# EAGLE schematic PCB-E21-CMB6_v03-17 (EAGLE 7.7.0)

## Sheet 1 of 2
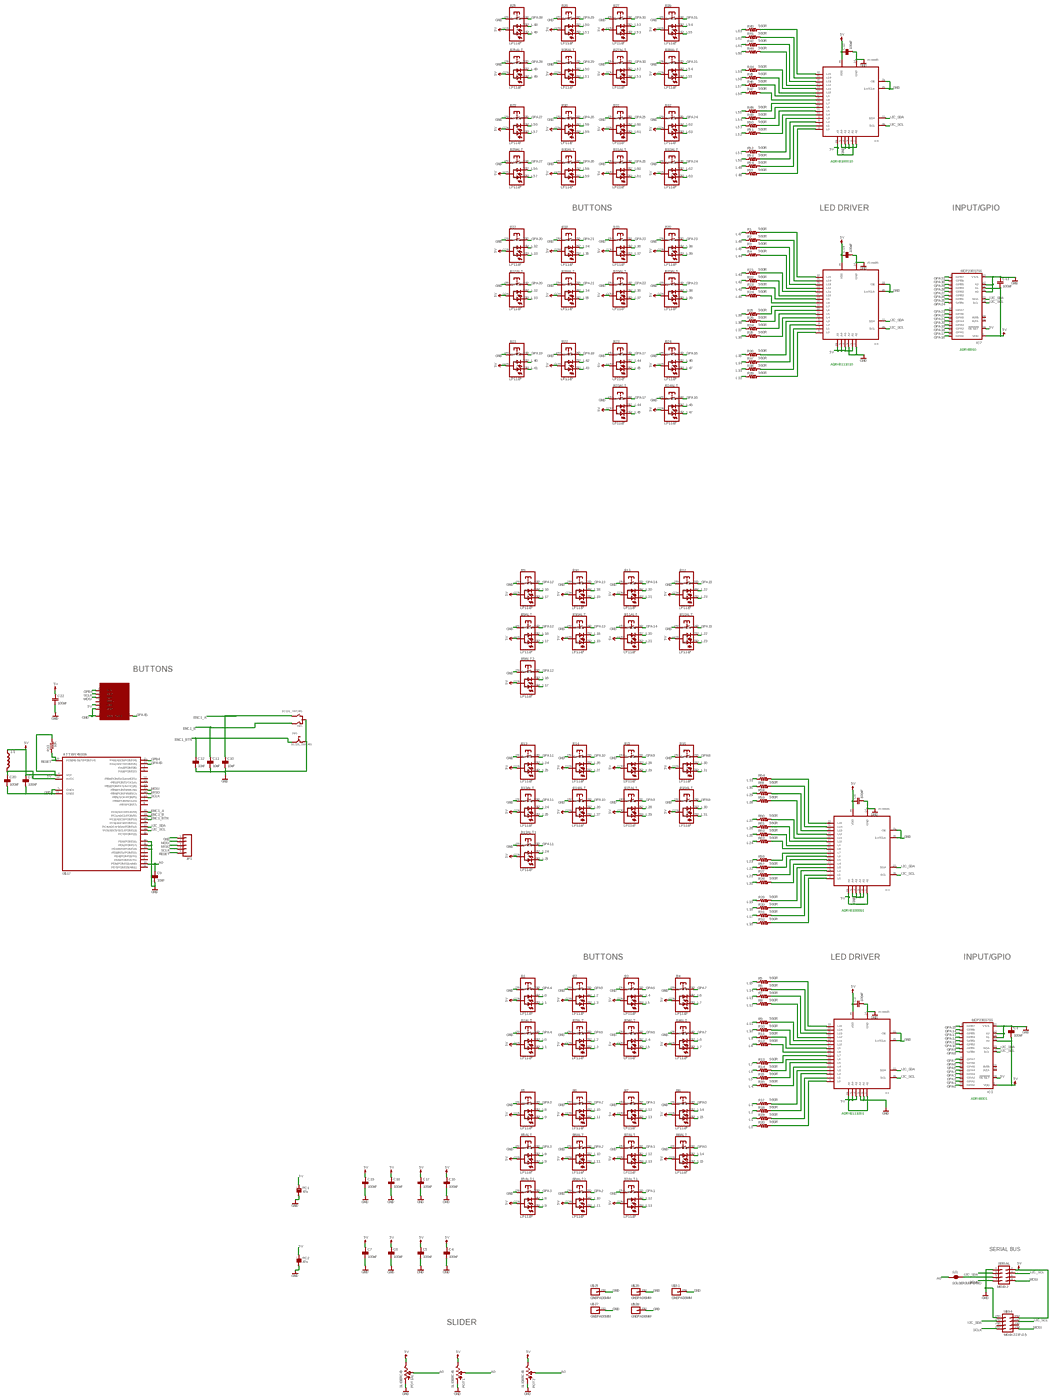
[diagram p0: schematic, sheet 1, overview]
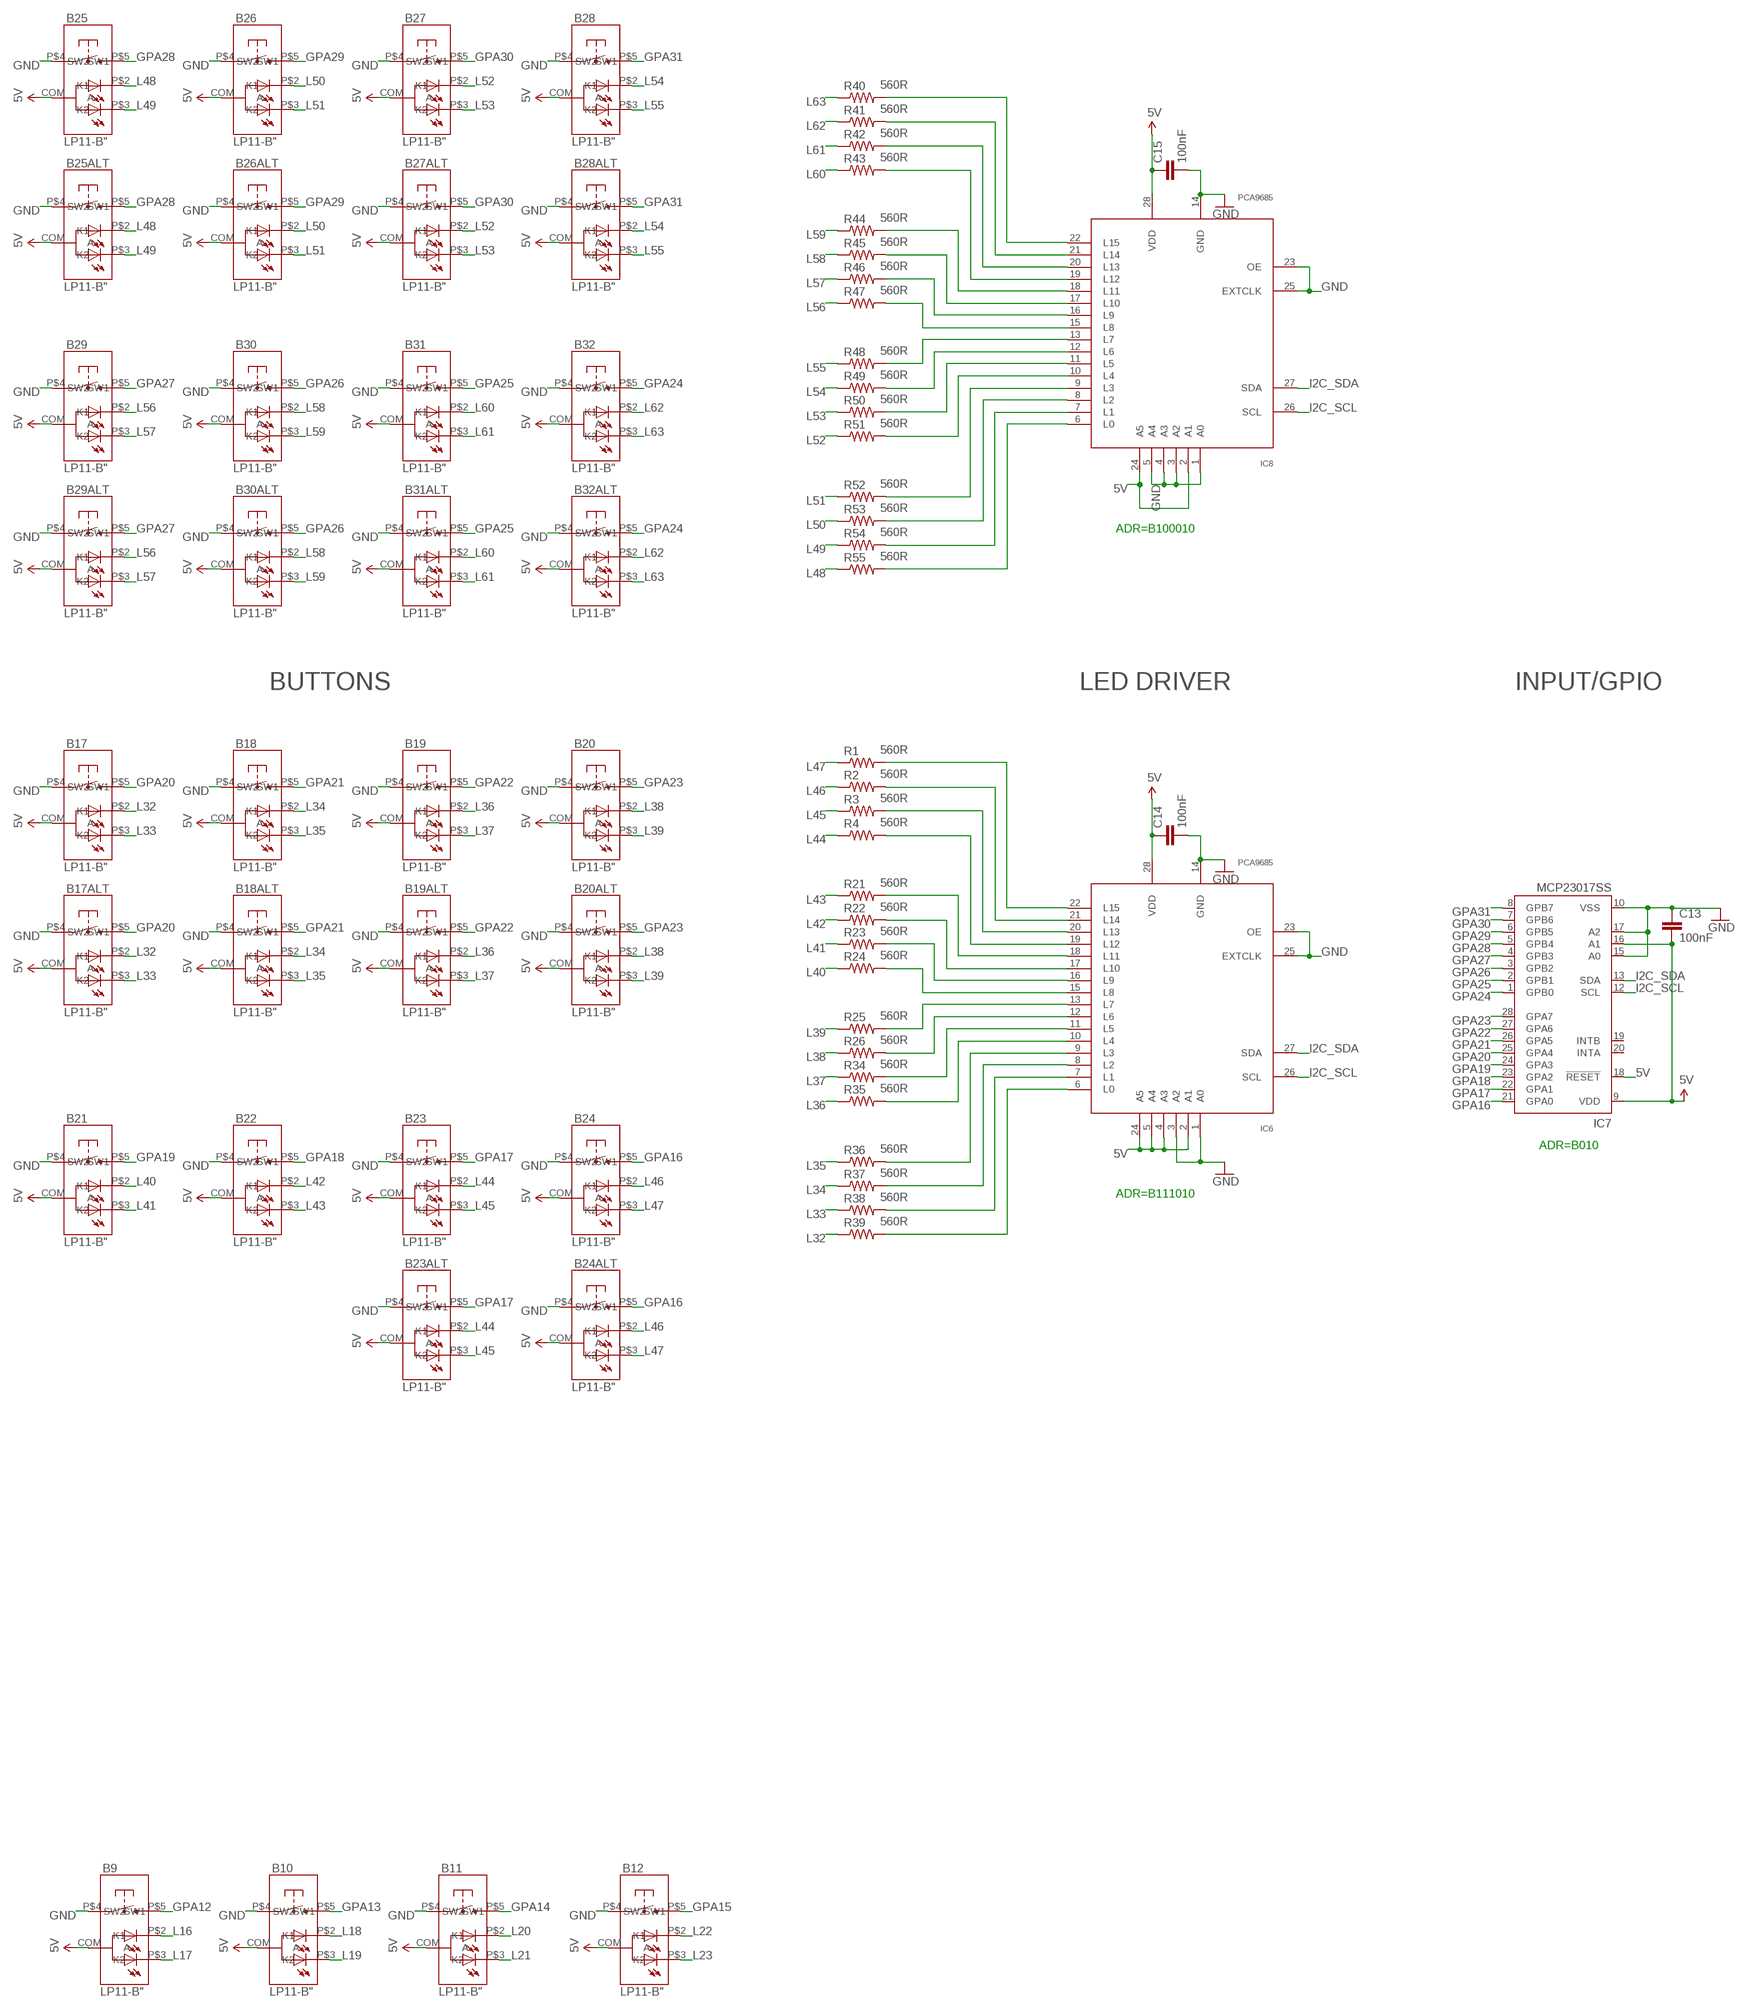
[diagram p1: schematic, sheet 1, part 1 of 5]
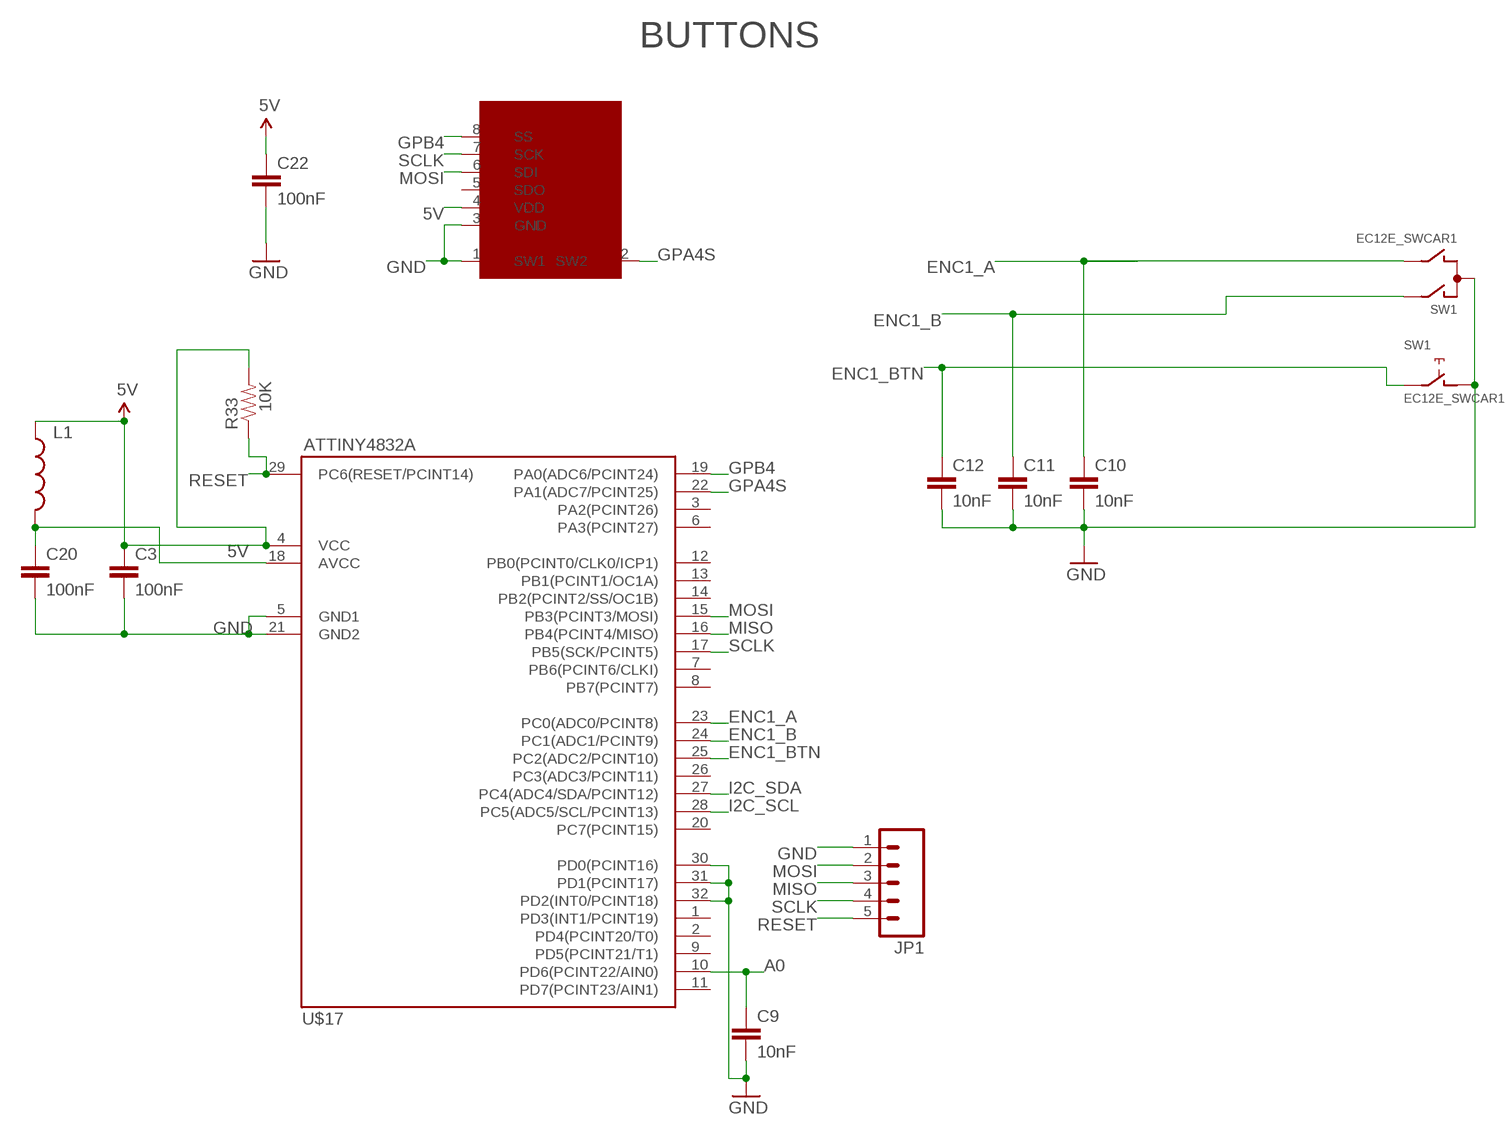
[diagram p2: schematic, sheet 1, part 2 of 5]
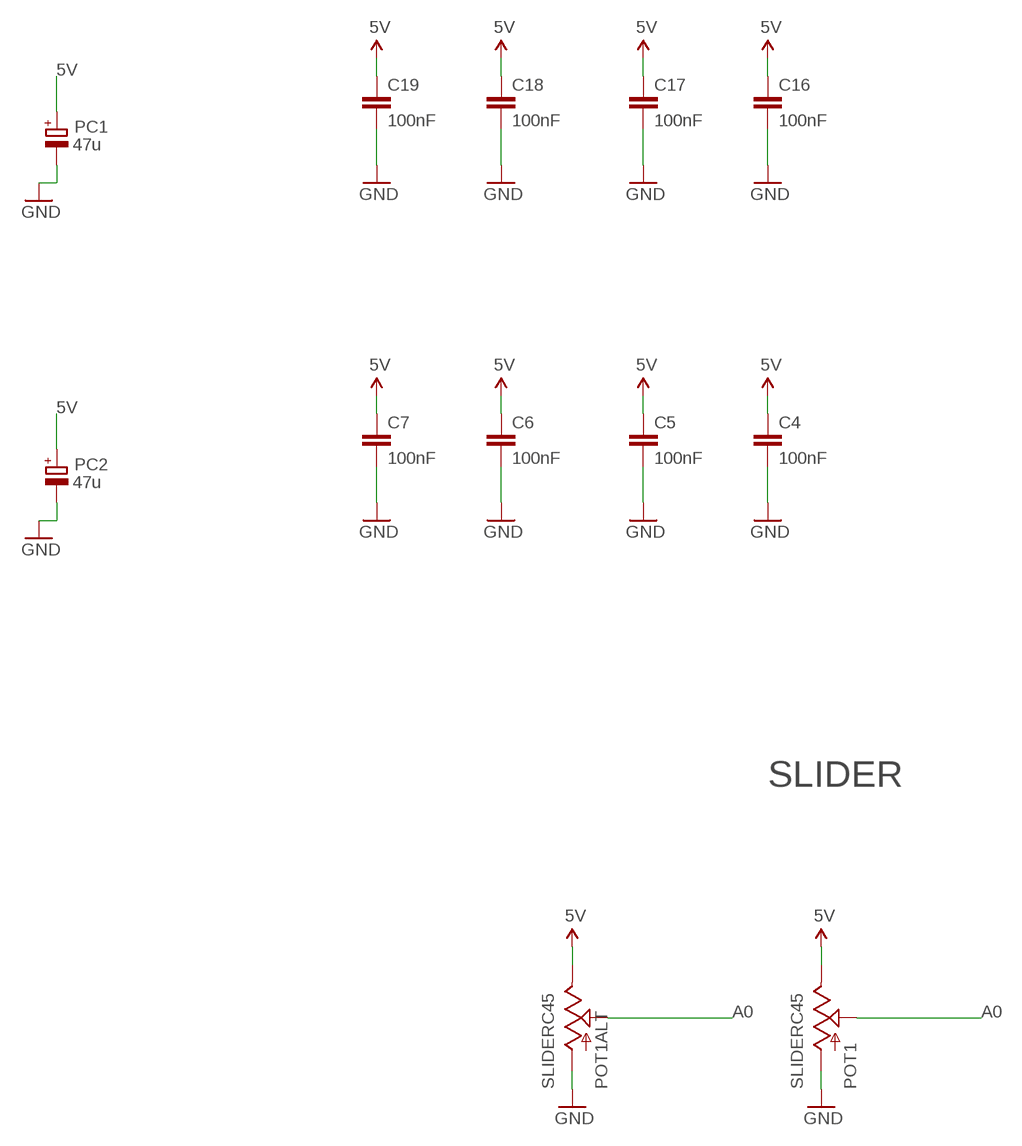
[diagram p3: schematic, sheet 1, part 3 of 5]
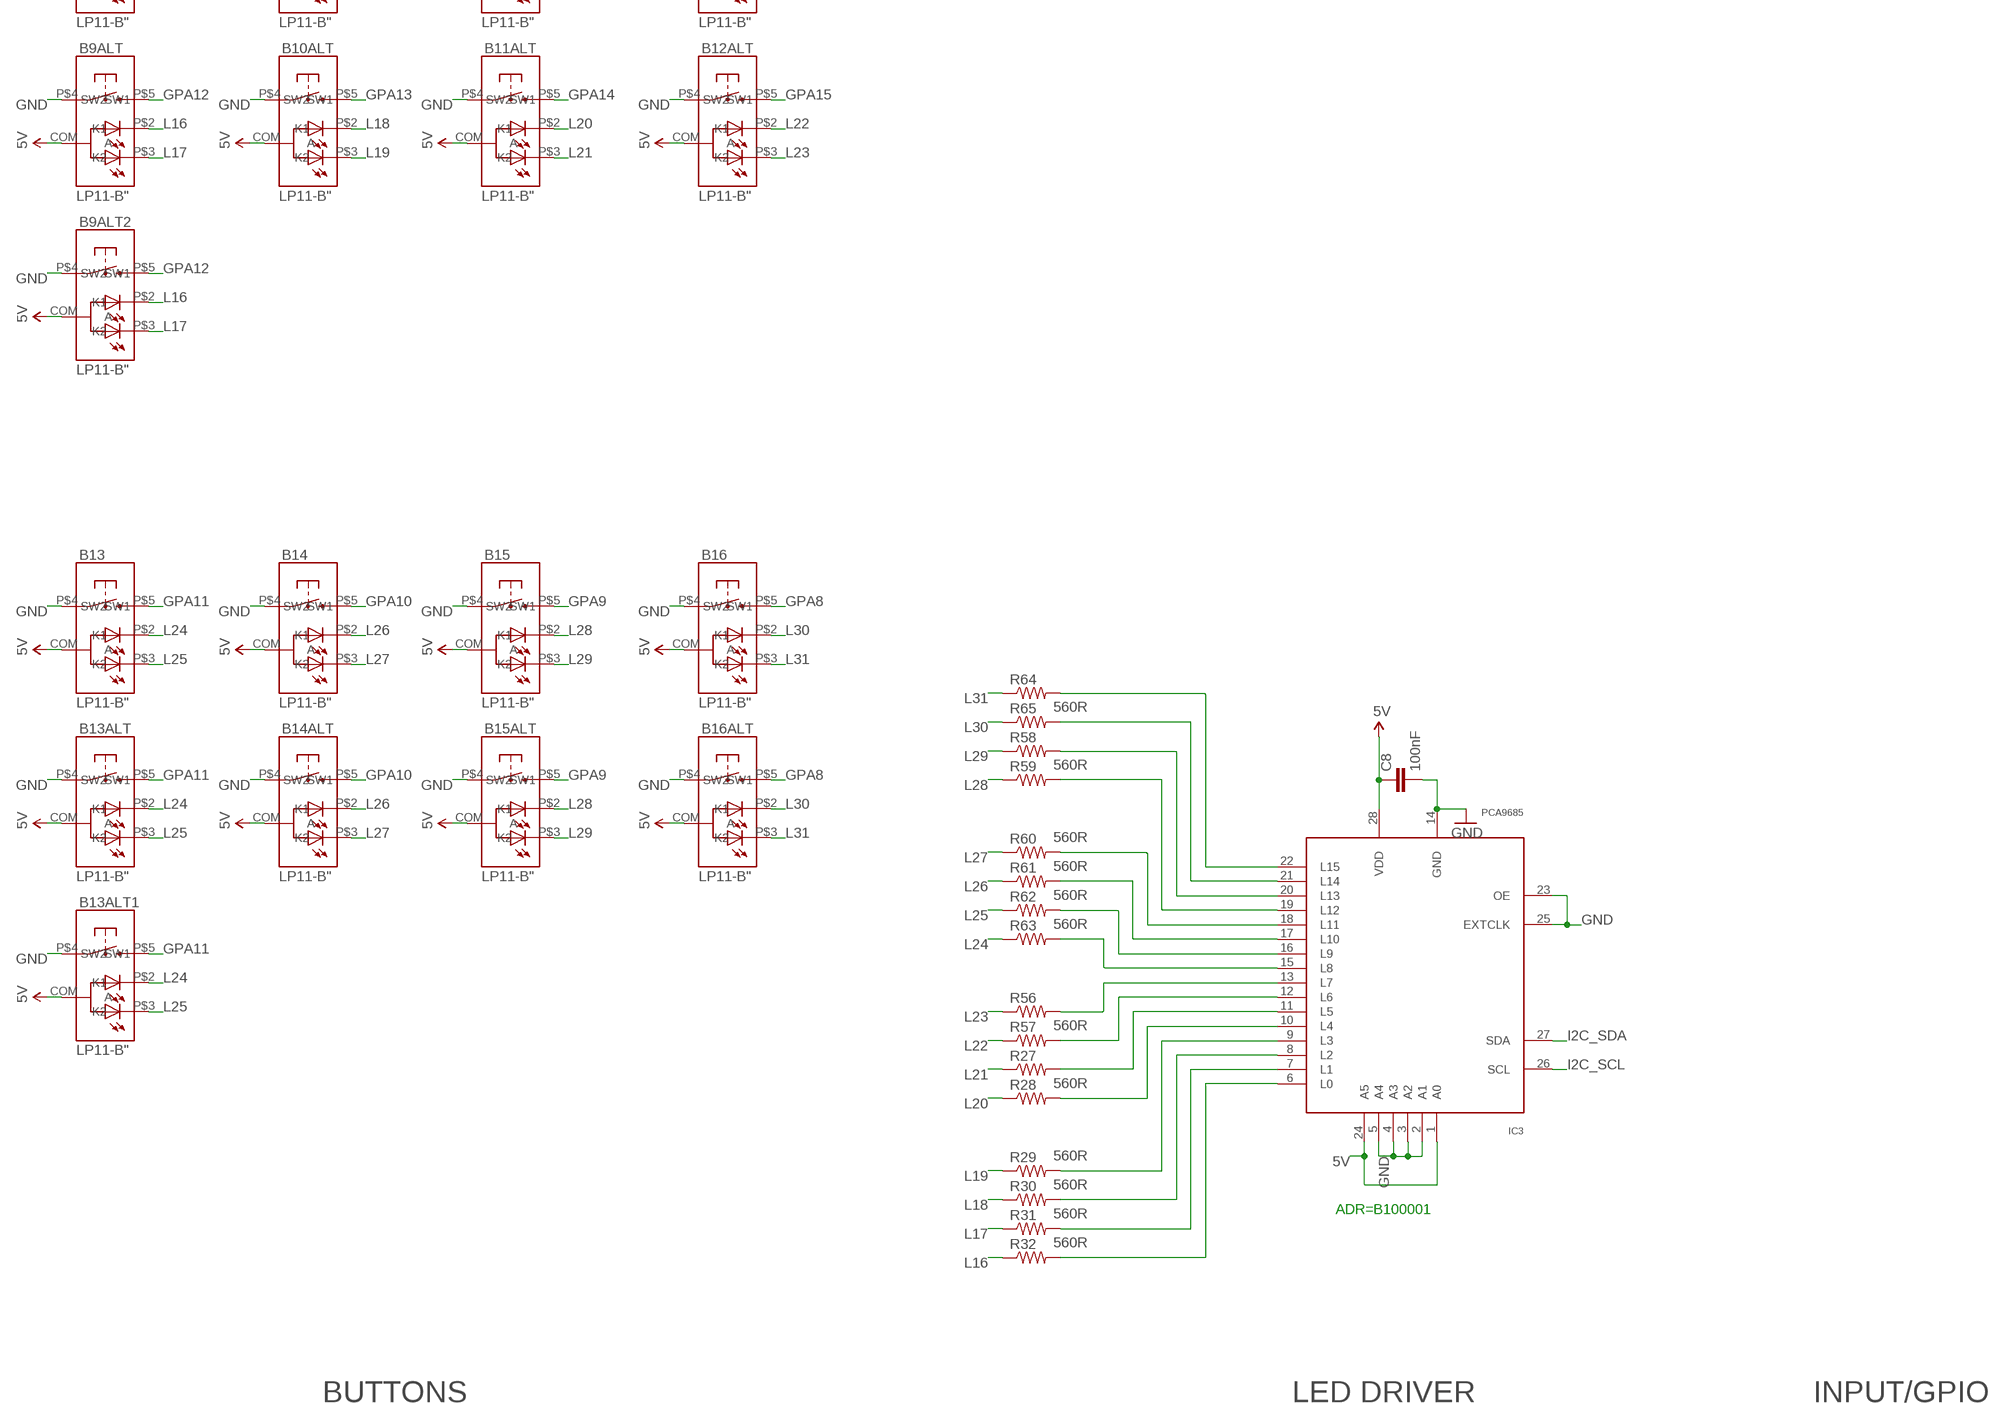
[diagram p4: schematic, sheet 1, part 4 of 5]
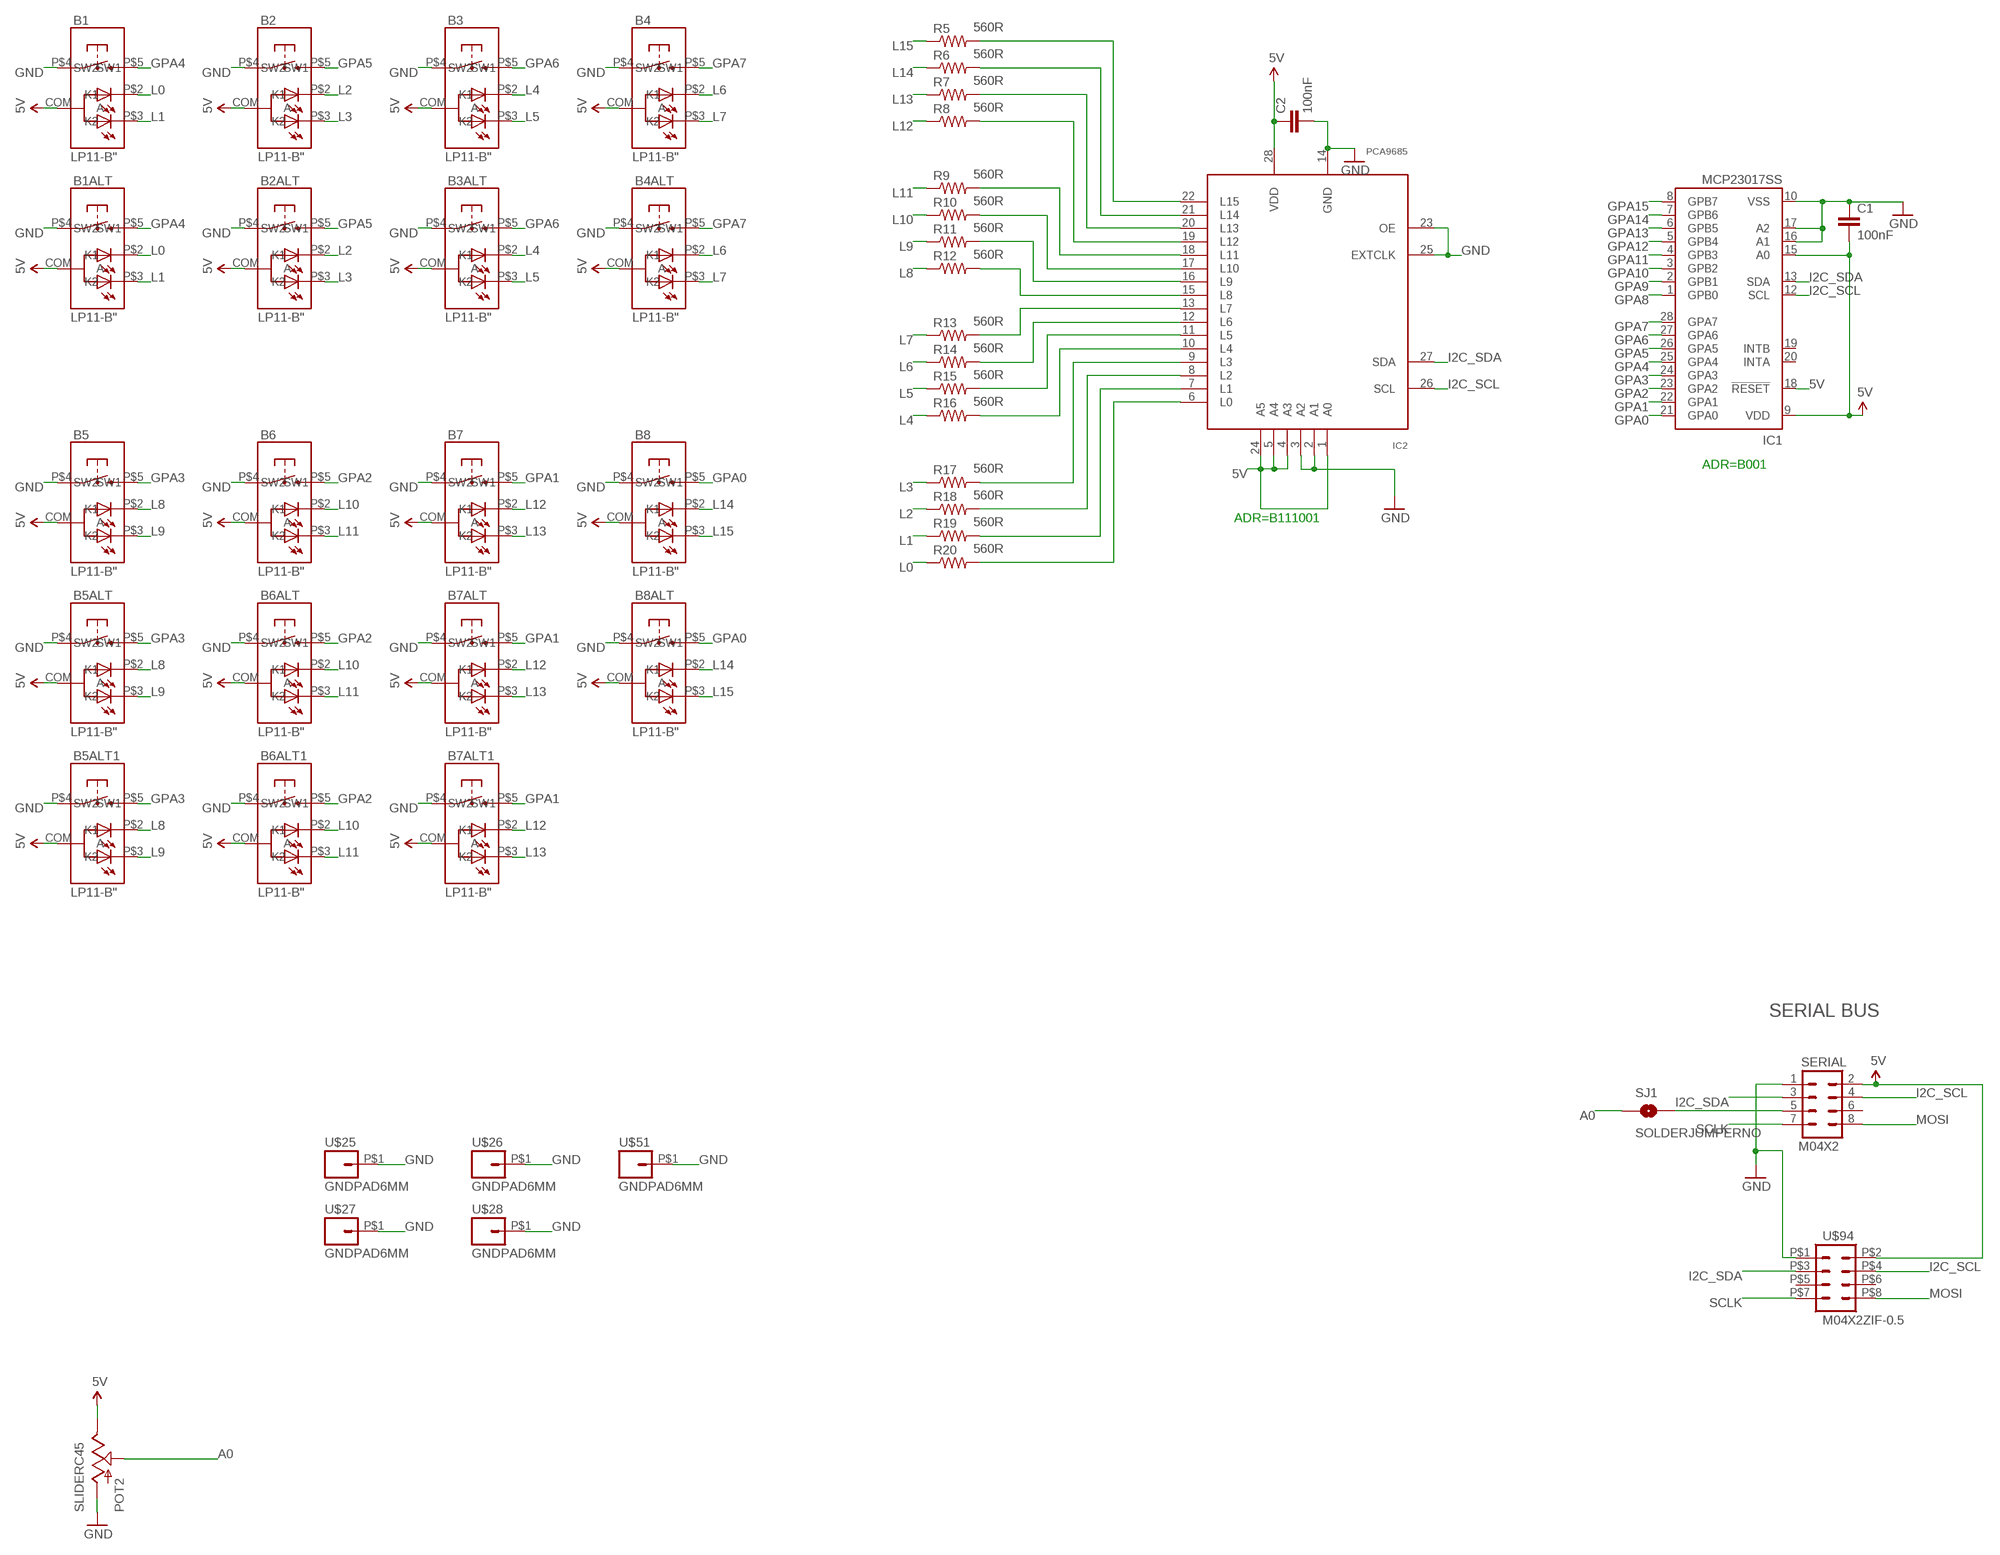
[diagram p5: schematic, sheet 1, part 5 of 5]

### Parts
B1  LP11-B"  [LP11]
B1ALT  LP11-B"  [LP11]
B2  LP11-B"  [LP11]
B2ALT  LP11-B"  [LP11]
B3  LP11-B"  [LP11]
B3ALT  LP11-B"  [LP11]
B4  LP11-B"  [LP11]
B4ALT  LP11-B"  [LP11]
B5  LP11-B"  [LP11]
B5ALT  LP11-B"  [LP11]
B5ALT1  LP11-B"  [LP11]
B6  LP11-B"  [LP11]
B6ALT  LP11-B"  [LP11]
B6ALT1  LP11-B"  [LP11]
B7  LP11-B"  [LP11]
B7ALT  LP11-B"  [LP11]
B7ALT1  LP11-B"  [LP11]
B8  LP11-B"  [LP11]
B8ALT  LP11-B"  [LP11]
B9  LP11-B"  [LP11]
B9ALT  LP11-B"  [LP11]
B9ALT2  LP11-B"  [LP11]
B10  LP11-B"  [LP11]
B10ALT  LP11-B"  [LP11]
B11  LP11-B"  [LP11]
B11ALT  LP11-B"  [LP11]
B12  LP11-B"  [LP11]
B12ALT  LP11-B"  [LP11]
B13  LP11-B"  [LP11]
B13ALT  LP11-B"  [LP11]
B13ALT1  LP11-B"  [LP11]
B14  LP11-B"  [LP11]
B14ALT  LP11-B"  [LP11]
B15  LP11-B"  [LP11]
B15ALT  LP11-B"  [LP11]
B16  LP11-B"  [LP11]
B16ALT  LP11-B"  [LP11]
B17  LP11-B"  [LP11]
B17ALT  LP11-B"  [LP11]
B18  LP11-B"  [LP11]
B18ALT  LP11-B"  [LP11]
B19  LP11-B"  [LP11]
B19ALT  LP11-B"  [LP11]
B20  LP11-B"  [LP11]
B20ALT  LP11-B"  [LP11]
B21  LP11-B"  [LP11]
B22  LP11-B"  [LP11]
B23  LP11-B"  [LP11]
B23ALT  LP11-B"  [LP11]
B24  LP11-B"  [LP11]
B24ALT  LP11-B"  [LP11]
B25  LP11-B"  [LP11]
B25ALT  LP11-B"  [LP11]
B26  LP11-B"  [LP11]
B26ALT  LP11-B"  [LP11]
B27  LP11-B"  [LP11]
B27ALT  LP11-B"  [LP11]
B28  LP11-B"  [LP11]
B28ALT  LP11-B"  [LP11]
B29  LP11-B"  [LP11]
B29ALT  LP11-B"  [LP11]
B30  LP11-B"  [LP11]
B30ALT  LP11-B"  [LP11]
B31  LP11-B"  [LP11]
B31ALT  LP11-B"  [LP11]
B32  LP11-B"  [LP11]
B32ALT  LP11-B"  [LP11]
C1  100nF  CAP0603-CAP  [0603-CAP]
C2  100nF  CAP0603-CAP  [0603-CAP]
C3  100nF  CAP0603-CAP  [0603-CAP]
C4  100nF  CAP0603-CAP  [0603-CAP]
C5  100nF  CAP0603-CAP  [0603-CAP]
C6  100nF  CAP0603-CAP  [0603-CAP]
C7  100nF  CAP0603-CAP  [0603-CAP]
C8  100nF  CAP0603-CAP  [0603-CAP]
C9  10nF  CAP0603-CAP  [0603-CAP]
C10  10nF  CAP0603-CAP  [0603-CAP]
C11  10nF  CAP0603-CAP  [0603-CAP]
C12  10nF  CAP0603-CAP  [0603-CAP]
C13  100nF  CAP0603-CAP  [0603-CAP]
C14  100nF  CAP0603-CAP  [0603-CAP]
C15  100nF  CAP0603-CAP  [0603-CAP]
C16  100nF  CAP0603-CAP  [0603-CAP]
C17  100nF  CAP0603-CAP  [0603-CAP]
C18  100nF  CAP0603-CAP  [0603-CAP]
C19  100nF  CAP0603-CAP  [0603-CAP]
C20  100nF  CAP0603-CAP  [0603-CAP]
C22  100nF  CAP0603-CAP  [0603-CAP]
IC1  MCP23017SS  [SSOP28]
IC2  PCA9685  [TSSOP28]
IC3  PCA9685  [TSSOP28]
IC6  PCA9685  [TSSOP28]
IC7  MCP23017SS  [SSOP28]
IC8  PCA9685  [TSSOP28]
JP1  M051.27MM  [1X05-1.27MM]
L1  INDUCTOR0805  [0805]
PC1  47u  CPOL-EUD  [PANASONIC_D]
PC2  47u  CPOL-EUD  [PANASONIC_D]
POT1  SLIDERC45  [SLIDER45-CAR1]
POT1ALT  SLIDERC45  [SLIDER45-CAR1]
POT2  SLIDERC45  [SLIDER45-CAR1]
R1  560R  RESISTOR0603-RES  [0603-RES]
R2  560R  RESISTOR0603-RES  [0603-RES]
R3  560R  RESISTOR0603-RES  [0603-RES]
R4  560R  RESISTOR0603-RES  [0603-RES]
R5  560R  RESISTOR0603-RES  [0603-RES]
R6  560R  RESISTOR0603-RES  [0603-RES]
R7  560R  RESISTOR0603-RES  [0603-RES]
R8  560R  RESISTOR0603-RES  [0603-RES]
R9  560R  RESISTOR0603-RES  [0603-RES]
R10  560R  RESISTOR0603-RES  [0603-RES]
R11  560R  RESISTOR0603-RES  [0603-RES]
R12  560R  RESISTOR0603-RES  [0603-RES]
R13  560R  RESISTOR0603-RES  [0603-RES]
R14  560R  RESISTOR0603-RES  [0603-RES]
R15  560R  RESISTOR0603-RES  [0603-RES]
R16  560R  RESISTOR0603-RES  [0603-RES]
R17  560R  RESISTOR0603-RES  [0603-RES]
R18  560R  RESISTOR0603-RES  [0603-RES]
R19  560R  RESISTOR0603-RES  [0603-RES]
R20  560R  RESISTOR0603-RES  [0603-RES]
R21  560R  RESISTOR0603-RES  [0603-RES]
R22  560R  RESISTOR0603-RES  [0603-RES]
R23  560R  RESISTOR0603-RES  [0603-RES]
R24  560R  RESISTOR0603-RES  [0603-RES]
R25  560R  RESISTOR0603-RES  [0603-RES]
R26  560R  RESISTOR0603-RES  [0603-RES]
R27  560R  RESISTOR0603-RES  [0603-RES]
R28  560R  RESISTOR0603-RES  [0603-RES]
R29  560R  RESISTOR0603-RES  [0603-RES]
R30  560R  RESISTOR0603-RES  [0603-RES]
R31  560R  RESISTOR0603-RES  [0603-RES]
R32  560R  RESISTOR0603-RES  [0603-RES]
R33  10K  RESISTOR0603-RES  [0603-RES]
R34  560R  RESISTOR0603-RES  [0603-RES]
R35  560R  RESISTOR0603-RES  [0603-RES]
R36  560R  RESISTOR0603-RES  [0603-RES]
R37  560R  RESISTOR0603-RES  [0603-RES]
R38  560R  RESISTOR0603-RES  [0603-RES]
R39  560R  RESISTOR0603-RES  [0603-RES]
R40  560R  RESISTOR0603-RES  [0603-RES]
R41  560R  RESISTOR0603-RES  [0603-RES]
R42  560R  RESISTOR0603-RES  [0603-RES]
R43  560R  RESISTOR0603-RES  [0603-RES]
R44  560R  RESISTOR0603-RES  [0603-RES]
R45  560R  RESISTOR0603-RES  [0603-RES]
R46  560R  RESISTOR0603-RES  [0603-RES]
R47  560R  RESISTOR0603-RES  [0603-RES]
R48  560R  RESISTOR0603-RES  [0603-RES]
R49  560R  RESISTOR0603-RES  [0603-RES]
R50  560R  RESISTOR0603-RES  [0603-RES]
R51  560R  RESISTOR0603-RES  [0603-RES]
R52  560R  RESISTOR0603-RES  [0603-RES]
R53  560R  RESISTOR0603-RES  [0603-RES]
R54  560R  RESISTOR0603-RES  [0603-RES]
R55  560R  RESISTOR0603-RES  [0603-RES]
R56  560R  RESISTOR0603-RES  [0603-RES]
R57  560R  RESISTOR0603-RES  [0603-RES]
R58  560R  RESISTOR0603-RES  [0603-RES]
R59  560R  RESISTOR0603-RES  [0603-RES]
R60  560R  RESISTOR0603-RES  [0603-RES]
R61  560R  RESISTOR0603-RES  [0603-RES]
R62  560R  RESISTOR0603-RES  [0603-RES]
R63  560R  RESISTOR0603-RES  [0603-RES]
R64  560R  RESISTOR0603-RES  [0603-RES]
R65  560R  RESISTOR0603-RES  [0603-RES]
SERIAL  M04X2  [2X4]
SJ1  SOLDERJUMPERNO  [SJ_2S-NO]
SSW1  SMART_SWITCHSMART_SWITCH_8PIN  [SMART_SWITCH]
SW1  EC12E_SWCAR1  [ALPS_EC12E_SW-CAR1]
U$17  ATTINY4832A  [TQFP32-08]
U$25  GNDPAD6MM  [3.2MMPAD6MM]
U$26  GNDPAD6MM  [3.2MMPAD6MM]
U$27  GNDPAD6MM  [3.2MMPAD6MM]
U$28  GNDPAD6MM  [3.2MMPAD6MM]
U$51  GNDPAD6MM  [3.2MMPAD6MM]
U$94  M04X2ZIF-0.5  [ZIP-8-0.5]

### Nets
5V [Power]: B1.COM(A) B1ALT.COM(A) B2.COM(A) B2ALT.COM(A) B3.COM(A) B3ALT.COM(A) B4.COM(A) B4ALT.COM(A) B5.COM(A) B5ALT1.COM(A) B5ALT.COM(A) B6.COM(A) B6ALT1.COM(A) B6ALT.COM(A) B7.COM(A) B7ALT1.COM(A) B7ALT.COM(A) B8.COM(A) B8ALT.COM(A) B9.COM(A) B9ALT2.COM(A) B9ALT.COM(A) B10.COM(A) B10ALT.COM(A) B11.COM(A) B11ALT.COM(A) B12.COM(A) B12ALT.COM(A) B13.COM(A) B13ALT1.COM(A) B13ALT.COM(A) B14.COM(A) B14ALT.COM(A) B15.COM(A) B15ALT.COM(A) B16.COM(A) B16ALT.COM(A) B17.COM(A) B17ALT.COM(A) B18.COM(A) B18ALT.COM(A) B19.COM(A) B19ALT.COM(A) B20.COM(A) B20ALT.COM(A) B21.COM(A) B22.COM(A) B23.COM(A) B23ALT.COM(A) B24.COM(A) B24ALT.COM(A) B25.COM(A) B25ALT.COM(A) B26.COM(A) B26ALT.COM(A) B27.COM(A) B27ALT.COM(A) B28.COM(A) B28ALT.COM(A) B29.COM(A) B29ALT.COM(A) B30.COM(A) B30ALT.COM(A) B31.COM(A) B31ALT.COM(A) B32.COM(A) B32ALT.COM(A) C1.2 C2.1 C3.1 C4.1 C5.1 C6.1 C7.1 C8.1 C13.2 C14.1 C15.1 C16.1 C17.1 C18.1 C19.1 C22.1 IC1.9(VDD) IC1.15(A0) IC1.18(!RESET) IC2.1(A0) IC2.4(A3) IC2.5(A4) IC2.24(A5) IC2.28(VDD) IC3.1(A0) IC3.24(A5) IC3.28(VDD) IC6.2(A1) IC6.4(A3) IC6.5(A4) IC6.24(A5) IC6.28(VDD) IC7.9(VDD) IC7.16(A1) IC7.18(!RESET) IC8.2(A1) IC8.24(A5) IC8.28(VDD) L1.1 PC1.+ PC2.+ POT1.1(E) POT1ALT.1(E) POT2.1(E) R33.2 SERIAL.2 SSW1.4(VDD) U$17.4(VCC) U$94.P$2
A0: C9.1 POT1.2A(S) POT1ALT.2A(S) POT2.2A(S) SJ1.1 U$17.10(PD6(PCINT22/AIN0))
ENC1_A: C10.1 SW1.B U$17.23(PC0(ADC0/PCINT8))
ENC1_B: C11.1 SW1.A U$17.24(PC1(ADC1/PCINT9))
ENC1_BTN: C12.1 SW1.E U$17.25(PC2(ADC2/PCINT10))
GND [Power]: B1.P$4(SW1) B1ALT.P$4(SW1) B2.P$4(SW1) B2ALT.P$4(SW1) B3.P$4(SW1) B3ALT.P$4(SW1) B4.P$4(SW1) B4ALT.P$4(SW1) B5.P$4(SW1) B5ALT1.P$4(SW1) B5ALT.P$4(SW1) B6.P$4(SW1) B6ALT1.P$4(SW1) B6ALT.P$4(SW1) B7.P$4(SW1) B7ALT1.P$4(SW1) B7ALT.P$4(SW1) B8.P$4(SW1) B8ALT.P$4(SW1) B9.P$4(SW1) B9ALT2.P$4(SW1) B9ALT.P$4(SW1) B10.P$4(SW1) B10ALT.P$4(SW1) B11.P$4(SW1) B11ALT.P$4(SW1) B12.P$4(SW1) B12ALT.P$4(SW1) B13.P$4(SW1) B13ALT1.P$4(SW1) B13ALT.P$4(SW1) B14.P$4(SW1) B14ALT.P$4(SW1) B15.P$4(SW1) B15ALT.P$4(SW1) B16.P$4(SW1) B16ALT.P$4(SW1) B17.P$4(SW1) B17ALT.P$4(SW1) B18.P$4(SW1) B18ALT.P$4(SW1) B19.P$4(SW1) B19ALT.P$4(SW1) B20.P$4(SW1) B20ALT.P$4(SW1) B21.P$4(SW1) B22.P$4(SW1) B23.P$4(SW1) B23ALT.P$4(SW1) B24.P$4(SW1) B24ALT.P$4(SW1) B25.P$4(SW1) B25ALT.P$4(SW1) B26.P$4(SW1) B26ALT.P$4(SW1) B27.P$4(SW1) B27ALT.P$4(SW1) B28.P$4(SW1) B28ALT.P$4(SW1) B29.P$4(SW1) B29ALT.P$4(SW1) B30.P$4(SW1) B30ALT.P$4(SW1) B31.P$4(SW1) B31ALT.P$4(SW1) B32.P$4(SW1) B32ALT.P$4(SW1) C1.1 C2.2 C3.2 C4.2 C5.2 C6.2 C7.2 C8.2 C9.2 C10.2 C11.2 C12.2 C13.1 C14.2 C15.2 C16.2 C17.2 C18.2 C19.2 C20.2 C22.2 IC1.10(VSS) IC1.16(A1) IC1.17(A2) IC2.2(A1) IC2.3(A2) IC2.14(GND) IC2.23(OE) IC2.25(EXTCLK) IC3.2(A1) IC3.3(A2) IC3.4(A3) IC3.5(A4) IC3.14(GND) IC3.23(OE) IC3.25(EXTCLK) IC6.1(A0) IC6.3(A2) IC6.14(GND) IC6.23(OE) IC6.25(EXTCLK) IC7.10(VSS) IC7.15(A0) IC7.17(A2) IC8.1(A0) IC8.3(A2) IC8.4(A3) IC8.5(A4) IC8.14(GND) IC8.23(OE) IC8.25(EXTCLK) JP1.1 PC1.- PC2.- POT1.3(A) POT1ALT.3(A) POT2.3(A) SERIAL.1 SSW1.1(SW1) SSW1.3(GND) SW1.C SW1.D U$17.5(GND1) U$17.21(GND2) U$17.30(PD0(PCINT16)) U$17.31(PD1(PCINT17)) U$17.32(PD2(INT0/PCINT18)) U$25.P$1 U$26.P$1 U$27.P$1 U$28.P$1 U$51.P$1 U$94.P$1
GPA0: B8.P$5(SW2) B8ALT.P$5(SW2) IC1.21(GPA0)
GPA1: B7.P$5(SW2) B7ALT1.P$5(SW2) B7ALT.P$5(SW2) IC1.22(GPA1)
GPA2: B6.P$5(SW2) B6ALT1.P$5(SW2) B6ALT.P$5(SW2) IC1.23(GPA2)
GPA3: B5.P$5(SW2) B5ALT1.P$5(SW2) B5ALT.P$5(SW2) IC1.24(GPA3)
GPA4: B1.P$5(SW2) B1ALT.P$5(SW2) IC1.25(GPA4)
GPA4S: SSW1.2(SW2) U$17.22(PA1(ADC7/PCINT25))
GPA5: B2.P$5(SW2) B2ALT.P$5(SW2) IC1.26(GPA5)
GPA6: B3.P$5(SW2) B3ALT.P$5(SW2) IC1.27(GPA6)
GPA7: B4.P$5(SW2) B4ALT.P$5(SW2) IC1.28(GPA7)
GPA8: B16.P$5(SW2) B16ALT.P$5(SW2) IC1.1(GPB0)
GPA9: B15.P$5(SW2) B15ALT.P$5(SW2) IC1.2(GPB1)
GPA10: B14.P$5(SW2) B14ALT.P$5(SW2) IC1.3(GPB2)
GPA11: B13.P$5(SW2) B13ALT1.P$5(SW2) B13ALT.P$5(SW2) IC1.4(GPB3)
GPA12: B9.P$5(SW2) B9ALT2.P$5(SW2) B9ALT.P$5(SW2) IC1.5(GPB4)
GPA13: B10.P$5(SW2) B10ALT.P$5(SW2) IC1.6(GPB5)
GPA14: B11.P$5(SW2) B11ALT.P$5(SW2) IC1.7(GPB6)
GPA15: B12.P$5(SW2) B12ALT.P$5(SW2) IC1.8(GPB7)
GPA16: B24.P$5(SW2) B24ALT.P$5(SW2) IC7.21(GPA0)
GPA17: B23.P$5(SW2) B23ALT.P$5(SW2) IC7.22(GPA1)
GPA18: B22.P$5(SW2) IC7.23(GPA2)
GPA19: B21.P$5(SW2) IC7.24(GPA3)
GPA20: B17.P$5(SW2) B17ALT.P$5(SW2) IC7.25(GPA4)
GPA21: B18.P$5(SW2) B18ALT.P$5(SW2) IC7.26(GPA5)
GPA22: B19.P$5(SW2) B19ALT.P$5(SW2) IC7.27(GPA6)
GPA23: B20.P$5(SW2) B20ALT.P$5(SW2) IC7.28(GPA7)
GPA24: B32.P$5(SW2) B32ALT.P$5(SW2) IC7.1(GPB0)
GPA25: B31.P$5(SW2) B31ALT.P$5(SW2) IC7.2(GPB1)
GPA26: B30.P$5(SW2) B30ALT.P$5(SW2) IC7.3(GPB2)
GPA27: B29.P$5(SW2) B29ALT.P$5(SW2) IC7.4(GPB3)
GPA28: B25.P$5(SW2) B25ALT.P$5(SW2) IC7.5(GPB4)
GPA29: B26.P$5(SW2) B26ALT.P$5(SW2) IC7.6(GPB5)
GPA30: B27.P$5(SW2) B27ALT.P$5(SW2) IC7.7(GPB6)
GPA31: B28.P$5(SW2) B28ALT.P$5(SW2) IC7.8(GPB7)
GPB4: SSW1.8(SS) U$17.19(PA0(ADC6/PCINT24))
I2C_SCL: IC1.12(SCL) IC2.26(SCL) IC3.26(SCL) IC6.26(SCL) IC7.12(SCL) IC8.26(SCL) SERIAL.4 U$17.28(PC5(ADC5/SCL/PCINT13)) U$94.P$4
I2C_SDA: IC1.13(SDA) IC2.27(SDA) IC3.27(SDA) IC6.27(SDA) IC7.13(SDA) IC8.27(SDA) SERIAL.3 U$17.27(PC4(ADC4/SDA/PCINT12)) U$94.P$3
L0: B1.P$2(K1) B1ALT.P$2(K1) R20.1
L1: B1.P$3(K2) B1ALT.P$3(K2) R19.1
L2: B2.P$2(K1) B2ALT.P$2(K1) R18.1
L3: B2.P$3(K2) B2ALT.P$3(K2) R17.1
L4: B3.P$2(K1) B3ALT.P$2(K1) R16.1
L5: B3.P$3(K2) B3ALT.P$3(K2) R15.1
L6: B4.P$2(K1) B4ALT.P$2(K1) R14.1
L7: B4.P$3(K2) B4ALT.P$3(K2) R13.1
L8: B5.P$2(K1) B5ALT1.P$2(K1) B5ALT.P$2(K1) R12.1
L9: B5.P$3(K2) B5ALT1.P$3(K2) B5ALT.P$3(K2) R11.1
L10: B6.P$2(K1) B6ALT1.P$2(K1) B6ALT.P$2(K1) R10.1
L11: B6.P$3(K2) B6ALT1.P$3(K2) B6ALT.P$3(K2) R9.1
L12: B7.P$2(K1) B7ALT1.P$2(K1) B7ALT.P$2(K1) R8.1
L13: B7.P$3(K2) B7ALT1.P$3(K2) B7ALT.P$3(K2) R7.1
L14: B8.P$2(K1) B8ALT.P$2(K1) R6.1
L15: B8.P$3(K2) B8ALT.P$3(K2) R5.1
L16: B9.P$2(K1) B9ALT2.P$2(K1) B9ALT.P$2(K1) R32.1
L17: B9.P$3(K2) B9ALT2.P$3(K2) B9ALT.P$3(K2) R31.1
L18: B10.P$2(K1) B10ALT.P$2(K1) R30.1
L19: B10.P$3(K2) B10ALT.P$3(K2) R29.1
L20: B11.P$2(K1) B11ALT.P$2(K1) R28.1
L21: B11.P$3(K2) B11ALT.P$3(K2) R27.1
L22: B12.P$2(K1) B12ALT.P$2(K1) R57.1
L23: B12.P$3(K2) B12ALT.P$3(K2) R56.1
L24: B13.P$2(K1) B13ALT1.P$2(K1) B13ALT.P$2(K1) R63.1
L25: B13.P$3(K2) B13ALT1.P$3(K2) B13ALT.P$3(K2) R62.1
L26: B14.P$2(K1) B14ALT.P$2(K1) R61.1
L27: B14.P$3(K2) B14ALT.P$3(K2) R60.1
L28: B15.P$2(K1) B15ALT.P$2(K1) R59.1
L29: B15.P$3(K2) B15ALT.P$3(K2) R58.1
L30: B16.P$2(K1) B16ALT.P$2(K1) R65.1
L31: B16.P$3(K2) B16ALT.P$3(K2) R64.1
L32: B17.P$2(K1) B17ALT.P$2(K1) R39.1
L33: B17.P$3(K2) B17ALT.P$3(K2) R38.1
L34: B18.P$2(K1) B18ALT.P$2(K1) R37.1
L35: B18.P$3(K2) B18ALT.P$3(K2) R36.1
L36: B19.P$2(K1) B19ALT.P$2(K1) R35.1
L37: B19.P$3(K2) B19ALT.P$3(K2) R34.1
L38: B20.P$2(K1) B20ALT.P$2(K1) R26.1
L39: B20.P$3(K2) B20ALT.P$3(K2) R25.1
L40: B21.P$2(K1) R24.1
L41: B21.P$3(K2) R23.1
L42: B22.P$2(K1) R22.1
L43: B22.P$3(K2) R21.1
L44: B23.P$2(K1) B23ALT.P$2(K1) R4.1
L45: B23.P$3(K2) B23ALT.P$3(K2) R3.1
L46: B24.P$2(K1) B24ALT.P$2(K1) R2.1
L47: B24.P$3(K2) B24ALT.P$3(K2) R1.1
L48: B25.P$2(K1) B25ALT.P$2(K1) R55.1
L49: B25.P$3(K2) B25ALT.P$3(K2) R54.1
L50: B26.P$2(K1) B26ALT.P$2(K1) R53.1
L51: B26.P$3(K2) B26ALT.P$3(K2) R52.1
L52: B27.P$2(K1) B27ALT.P$2(K1) R51.1
L53: B27.P$3(K2) B27ALT.P$3(K2) R50.1
L54: B28.P$2(K1) B28ALT.P$2(K1) R49.1
L55: B28.P$3(K2) B28ALT.P$3(K2) R48.1
L56: B29.P$2(K1) B29ALT.P$2(K1) R47.1
L57: B29.P$3(K2) B29ALT.P$3(K2) R46.1
L58: B30.P$2(K1) B30ALT.P$2(K1) R45.1
L59: B30.P$3(K2) B30ALT.P$3(K2) R44.1
L60: B31.P$2(K1) B31ALT.P$2(K1) R43.1
L61: B31.P$3(K2) B31ALT.P$3(K2) R42.1
L62: B32.P$2(K1) B32ALT.P$2(K1) R41.1
L63: B32.P$3(K2) B32ALT.P$3(K2) R40.1
MISO: JP1.3 U$17.16(PB4(PCINT4/MISO))
MOSI: JP1.2 SERIAL.8 SSW1.6(SDI) U$17.15(PB3(PCINT3/MOSI)) U$94.P$8
N$1: SERIAL.5 SJ1.2
N$2: IC6.13(L7) R25.2
N$3: IC3.11(L5) R27.2
N$4: IC2.13(L7) R13.2
N$5: IC2.12(L6) R14.2
N$6: IC3.10(L4) R28.2
N$7: IC2.11(L5) R15.2
N$8: IC3.9(L3) R29.2
N$9: IC2.10(L4) R16.2
N$10: IC2.9(L3) R17.2
N$11: IC2.8(L2) R18.2
N$12: IC2.7(L1) R19.2
N$13: IC3.8(L2) R30.2
N$14: IC3.7(L1) R31.2
N$15: IC3.6(L0) R32.2
N$16: IC6.12(L6) R26.2
N$17: IC6.11(L5) R34.2
N$18: IC6.10(L4) R35.2
N$19: IC2.6(L0) R20.2
N$20: IC2.15(L8) R12.2
N$21: IC2.16(L9) R11.2
N$22: IC2.17(L10) R10.2
N$23: IC2.18(L11) R9.2
N$24: IC2.19(L12) R8.2
N$25: IC2.20(L13) R7.2
N$26: IC2.21(L14) R6.2
N$27: IC2.22(L15) R5.2
N$28: IC6.9(L3) R36.2
N$29: IC6.8(L2) R37.2
N$30: IC6.7(L1) R38.2
N$31: IC6.6(L0) R39.2
N$32: IC6.15(L8) R24.2
N$33: C20.1 L1.2 U$17.18(AVCC)
N$34: IC6.16(L9) R23.2
N$35: IC6.17(L10) R22.2
N$36: IC6.18(L11) R21.2
N$37: IC6.19(L12) R4.2
N$38: IC6.20(L13) R3.2
N$39: IC6.21(L14) R2.2
N$40: IC6.22(L15) R1.2
N$41: IC8.13(L7) R48.2
N$42: IC8.12(L6) R49.2
N$43: IC8.11(L5) R50.2
N$44: IC8.10(L4) R51.2
N$45: IC8.9(L3) R52.2
N$46: IC8.8(L2) R53.2
N$47: IC8.7(L1) R54.2
N$48: IC8.6(L0) R55.2
N$49: IC8.15(L8) R47.2
N$50: IC8.16(L9) R46.2
N$51: IC8.17(L10) R45.2
N$52: IC8.18(L11) R44.2
N$53: IC8.19(L12) R43.2
N$54: IC8.20(L13) R42.2
N$55: IC8.21(L14) R41.2
N$56: IC8.22(L15) R40.2
N$57: IC3.12(L6) R57.2
N$58: IC3.13(L7) R56.2
N$59: IC3.15(L8) R63.2
N$60: IC3.16(L9) R62.2
N$61: IC3.17(L10) R61.2
N$62: IC3.18(L11) R60.2
N$63: IC3.19(L12) R59.2
N$64: IC3.20(L13) R58.2
N$65: IC3.21(L14) R65.2
N$66: IC3.22(L15) R64.2
RESET: JP1.5 R33.1 U$17.29(PC6(RESET/PCINT14))
SCLK: JP1.4 SERIAL.7 SSW1.7(SCK) U$17.17(PB5(SCK/PCINT5)) U$94.P$7
Unconnected: IC1.19(INTB) IC1.20(INTA) IC7.19(INTB) IC7.20(INTA) SERIAL.6 SSW1.5(SDO) SW1.GND1(G) SW1.GND2(G) U$17.1(PD3(INT1/PCINT19)) U$17.2(PD4(PCINT20/T0)) U$17.3(PA2(PCINT26)) U$17.6(PA3(PCINT27)) U$17.7(PB6(PCINT6/CLKI)) U$17.8(PB7(PCINT7)) U$17.9(PD5(PCINT21/T1)) U$17.11(PD7(PCINT23/AIN1)) U$17.12(PB0(PCINT0/CLK0/ICP1)) U$17.13(PB1(PCINT1/OC1A)) U$17.14(PB2(PCINT2/SS/OC1B)) U$17.20(PC7(PCINT15)) U$17.26(PC3(ADC3/PCINT11)) U$94.P$5 U$94.P$6

### Notes on the sheet
- ADR=B100010
- BUTTONS | LED DRIVER | INPUT/GPIO
- ADR=B010
- ADR=B111010
- BUTTONS
- ADR=B100001
- BUTTONS | LED DRIVER | INPUT/GPIO
- ADR=B001
- ADR=B111001
- SERIAL BUS
- SLIDER

## Sheet 2 of 2

## Library data of the parts
B1 B1ALT B2 B2ALT B3 B3ALT B4 B4ALT B5 B5ALT B5ALT1 B6 B6ALT B6ALT1 B7 B7ALT B7ALT1 B8 B8ALT B9 B9ALT B9ALT2 B10 B10ALT B11 B11ALT B12 B12ALT B13 B13ALT B13ALT1 B14 B14ALT B15 B15ALT B16 B16ALT B17 B17ALT B18 B18ALT B19 B19ALT B20 B20ALT B21-B23 B23ALT B24 B24ALT B25 B25ALT B26 B26ALT B27 B27ALT B28 B28ALT B29 B29ALT B30 B30ALT B31 B31ALT B32 B32ALT = SKAARHOJ:LP11-B
C1-C20 C22 = SparkFun:CAP: Capacitor Standard 0603 ceramic capacitor, and 0.1" leaded capacitor.
IC1 IC7 = microchip:MCP23017: http://ww1.microchip.com/downloads/en/DeviceDoc/21952a.pdf Source: http://ww1.microchip.com/downloads/en/DeviceDoc/21952a.pdf; MF: MICROCHIP; MPN: MCP23017-E/SS; OC_FARNELL: 1467674; OC_NEWARK: 31K2960
IC2 IC3 IC6 IC8 = wsmith:PCA9685
JP1 = SparkFun:M05: Header 5 Standard 5-pin 0.1" header. Use with straight break away headers (SKU : PRT-00116), right angle break away headers (PRT-00553), swiss pins (PRT-00743), machine pins (PRT-00117), and female headers (PRT-00115). Molex polarized connector foot print use with SKU : PRT-08230 with associated crimp pins and housings.
L1 = SparkFun:INDUCTOR: Inductors Basic Inductor/Choke - 0603 and 1206. Footprints are not proven and vary greatly between part numbers.
PC1 PC2 = rcl:CPOL-EU: POLARIZED CAPACITOR, European symbol
POT1 POT1ALT POT2 = SKAARHOJ:SLIDER
R1-R65 = SparkFun:RESISTOR: Resistor Basic schematic elements and footprints for 0603, 1206, and PTH resistors.
SERIAL = SparkFun:M04X2
SJ1 = SparkFun:SOLDERJUMPER: Solder Jumper Standard SMD solder jumper. Used to automate production. Two varients : Normally Open and Normally Closed are the same, but have different paste layers. NC will have a large amount of paste and should jumper during reflow.
SSW1 = SKAARHOJ:SMART_SWITCH: SMARTSWITCH IS15DSBFP4RGB www.nkksmartswitch.com
SW1 = SKAARHOJ:EC12E_SW: ALPS rotary Encoder EC12E series with switch
U$17 = SparkFun:ATTINY48: ATtiny48/88 in 32 pin configuration.
U$25-U$28 U$51 = SKAARHOJ:GNDPAD
U$94 = SKAARHOJ:M04X2

## Net classes
0 default: width 0.203 mm, drill 0.406 mm, clearance 0.152 mm
1 Power: width 0.406 mm, drill 0.61 mm, clearance 0.203 mm